# EAGLE design MCPv5_eingabe (EAGLE 9.6.2)
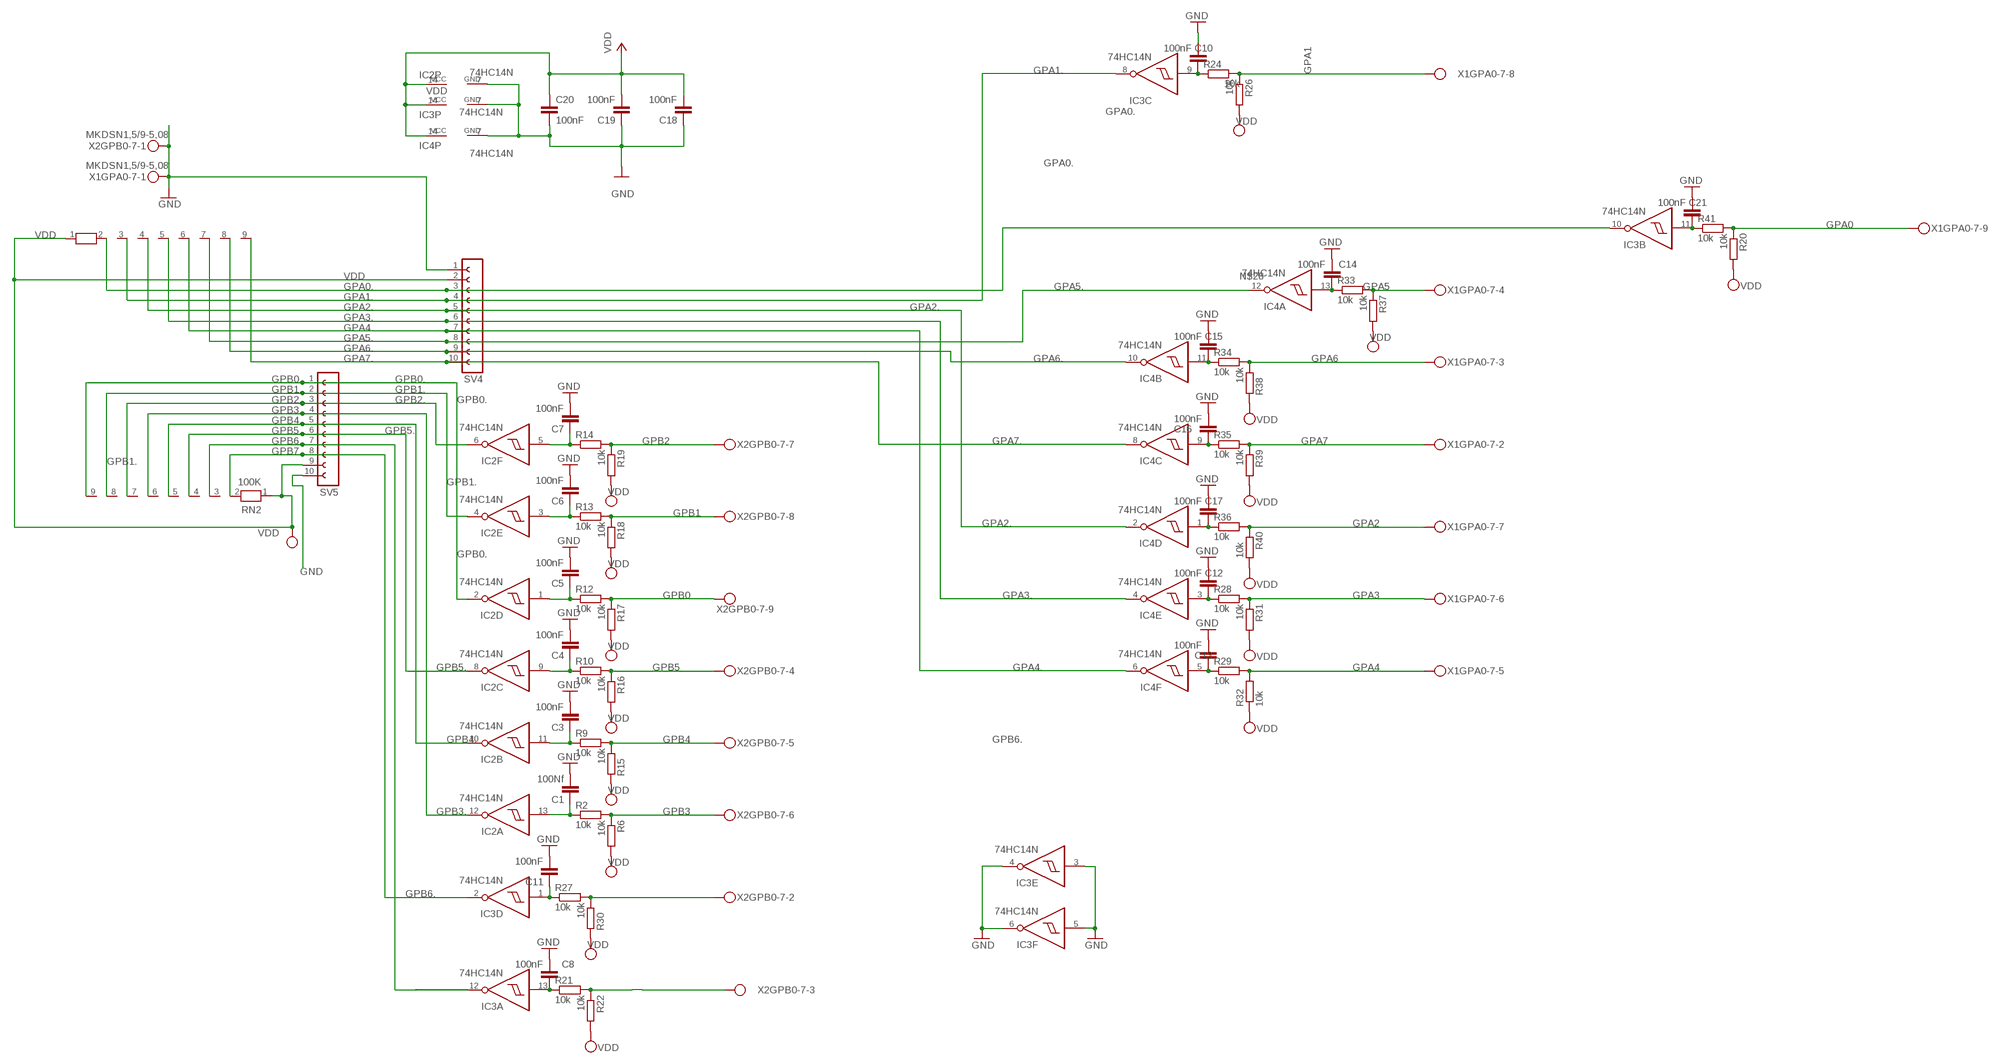
[diagram p0: schematic, sheet 1]

## Parts
C1  100Nf  C-EU025-024X044  [C025-024X044]
C3  100nF  C-EU025-024X044  [C025-024X044]
C4  100nF  C-EU025-024X044  [C025-024X044]
C5  100nF  C-EU025-024X044  [C025-024X044]
C6  100nF  C-EU025-024X044  [C025-024X044]
C7  100nF  C-EU025-024X044  [C025-024X044]
C8  100nF  C-EU025-024X044  [C025-024X044]
C10  100nF  C-EU025-024X044  [C025-024X044]
C11  100nF  C-EU025-024X044  [C025-024X044]
C12  100nF  C-EU025-024X044  [C025-024X044]
C13  100nF  C-EU025-024X044  [C025-024X044]
C14  100nF  C-EU025-024X044  [C025-024X044]
C15  100nF  C-EU025-024X044  [C025-024X044]
C16  100nF  C-EU025-024X044  [C025-024X044]
C17  100nF  C-EU025-024X044  [C025-024X044]
C18  100nF  C-EU025-024X044  [C025-024X044]
C19  100nF  C-EU025-024X044  [C025-024X044]
C20  100nF  C-EU025-024X044  [C025-024X044]
C21  100nF  C-EU025-024X044  [C025-024X044]
IC2  74HC14N  [DIL14]
IC3  74HC14N  [DIL14]
IC4  74HC14N  [DIL14]
R2  10k  R-EU_0204/7  [0204/7]
R6  10k  R-EU_0204/7  [0204/7]
R9  10k  R-EU_0204/7  [0204/7]
R10  10k  R-EU_0204/7  [0204/7]
R12  10k  R-EU_0204/7  [0204/7]
R13  10k  R-EU_0204/7  [0204/7]
R14  10k  R-EU_0204/7  [0204/7]
R15  10k  R-EU_0204/7  [0204/7]
R16  10k  R-EU_0204/7  [0204/7]
R17  10k  R-EU_0204/7  [0204/7]
R18  10k  R-EU_0204/7  [0204/7]
R19  10k  R-EU_0204/7  [0204/7]
R20  10k  R-EU_0204/7  [0204/7]
R21  10k  R-EU_0204/7  [0204/7]
R22  10k  R-EU_0204/7  [0204/7]
R24  10k  R-EU_0204/7  [0204/7]
R26  10k  R-EU_0204/7  [0204/7]
R27  10k  R-EU_0204/7  [0204/7]
R28  10k  R-EU_0204/7  [0204/7]
R29  10k  R-EU_0204/7  [0204/7]
R30  10k  R-EU_0204/7  [0204/7]
R31  10k  R-EU_0204/7  [0204/7]
R32  10k  R-EU_0204/7  [0204/7]
R33  10k  R-EU_0204/7  [0204/7]
R34  10k  R-EU_0204/7  [0204/7]
R35  10k  R-EU_0204/7  [0204/7]
R36  10k  R-EU_0204/7  [0204/7]
R37  10k  R-EU_0204/7  [0204/7]
R38  10k  R-EU_0204/7  [0204/7]
R39  10k  R-EU_0204/7  [0204/7]
R40  10k  R-EU_0204/7  [0204/7]
R41  10k  R-EU_0204/7  [0204/7]
RN1  100K  RN08  [RN-9]
RN2  100K  RN08  [RN-9]
SV4  FE10-1  [FE10]
SV5  FE10-1  [FE10]
X1GPA0-7  MKDSN1,5/9-5,08  [MKDSN1,5/9-5,08]
X2GPB0-7  MKDSN1,5/9-5,08  [MKDSN1,5/9-5,08]

## Nets
GND: C1.2 C3.2 C4.2 C5.2 C6.2 C7.2 C8.2 C10.2 C11.2 C12.2 C13.2 C14.2 C15.2 C16.2 C17.2 C18.1 C19.1 C20.2 C21.2 IC2.7(P:GND) IC3.3(E:I) IC3.4(E:O) IC3.5(F:I) IC3.6(F:O) IC3.7(P:GND) IC4.7(P:GND) SV4.1 SV5.10 X1GPA0-7.1 X2GPB0-7.1
GPA0: R20.1 R41.2 X1GPA0-7.9
GPA0.: IC3.10(B:O) RN1.2 SV4.3
GPA1: R24.2 R26.1 X1GPA0-7.8
GPA1.: IC3.8(C:O) RN1.3 SV4.4
GPA2: R36.2 R40.1 X1GPA0-7.7
GPA2.: IC4.2(D:O) RN1.4 SV4.5
GPA3: R28.2 R31.1 X1GPA0-7.6
GPA3.: IC4.4(E:O) RN1.5 SV4.6
GPA4: R29.2 R32.2 X1GPA0-7.5
GPA4.: IC4.6(F:O) RN1.6 SV4.7
GPA5: R33.2 R37.1 X1GPA0-7.4
GPA5.: IC4.12(A:O) RN1.7 SV4.8
GPA6: R34.2 R38.1 X1GPA0-7.3
GPA6.: IC4.10(B:O) RN1.8 SV4.9
GPA7: R35.2 R39.1 X1GPA0-7.2
GPA7.: IC4.8(C:O) RN1.9 SV4.10
GPB0: R12.2 R17.1 X2GPB0-7.9
GPB0.: IC2.2(D:O) RN2.9 SV5.1
GPB1: R13.2 R18.1 X2GPB0-7.8
GPB1.: IC2.4(E:O) RN2.8 SV5.2
GPB2: R14.2 R19.1 X2GPB0-7.7
GPB2.: IC2.6(F:O) RN2.7 SV5.3
GPB3: R2.2 R6.1 X2GPB0-7.6
GPB3.: IC2.12(A:O) RN2.6 SV5.4
GPB4: R9.2 R15.1 X2GPB0-7.5
GPB4.: IC2.10(B:O) RN2.5 SV5.5
GPB5: R10.2 R16.1 X2GPB0-7.4
GPB5.: IC2.8(C:O) RN2.4 SV5.6
GPB6: R21.2 R22.1 X2GPB0-7.3
GPB6.: IC3.12(A:O) RN2.3 SV5.7
GPB7: R27.2 R30.1 X2GPB0-7.2
GPB7.: IC3.2(D:O) RN2.2 SV5.8
N$2: C7.1 IC2.5(F:I) R14.1
N$4: C1.1 IC2.13(A:I) R2.1
N$5: C6.1 IC2.3(E:I) R13.1
N$6: C5.1 IC2.1(D:I) R12.1
N$7: C4.1 IC2.9(C:I) R10.1
N$8: C3.1 IC2.11(B:I) R9.1
N$9: C8.1 IC3.13(A:I) R21.1
N$10: C10.1 IC3.9(C:I) R24.1
N$11: C11.1 IC3.1(D:I) R27.1
N$12: C12.1 IC4.3(E:I) R28.1
N$13: C13.1 IC4.5(F:I) R29.1
N$16: C15.1 IC4.11(B:I) R34.1
N$20: C16.1 IC4.9(C:I) R35.1
N$21: C17.1 IC4.1(D:I) R36.1
N$28: C14.1 IC4.13(A:I) R33.1
N$52: C21.1 IC3.11(B:I) R41.1
VDD: C18.2 C19.2 C20.1 IC2.14(P:VCC) IC3.14(P:VCC) IC4.14(P:VCC) R6.2 R15.2 R16.2 R17.2 R18.2 R19.2 R20.2 R22.2 R26.2 R30.2 R31.2 R32.1 R37.2 R38.2 R39.2 R40.2 RN1.1 RN2.1 SV4.2 SV5.9

## Library data of the parts
C1 C3-C8 C10-C21 = rcl:C-EU: CAPACITOR, European symbol; SPICEPREFIX: C
IC2-IC4 = 74xx-eu:74*14: Hex schmitt trigger INVERTER
R2 R6 R9 R10 R12-R22 R24 R26-R41 = resistor:R-EU_: RESISTOR, European symbol
RN1 = resistor-net:RN08: RESISTOR NETWORK; OC_FARNELL: unknown; OC_NEWARK: unknown; SPICEPREFIX: X
RN2 = resistor-net:RN08: RESISTOR NETWORK; OC_FARNELL: unknown; OC_NEWARK: unknown
SV4 SV5 = con-lsta:FE10-1: FEMALE HEADER; OC_FARNELL: unknown; OC_NEWARK: unknown
X1GPA0-7 X2GPB0-7 = con-phoenix-508:MKDSN1,5/9-5,08: MKDSN 1,5/ 9-5,08 Printklemme Nennstrom: 13,5 A Nennspannung: 250 V Rastermaß: 5,08 mm Polzahl: 9 Anschlussart: Schraubanschluss Montage: Löten Anschlussrichtung Leiter/Platine: 0 ° Artikelnummer: 1729199 Source: http://eshop.phoenixcontact.com .. 1729199.pdf

## Board
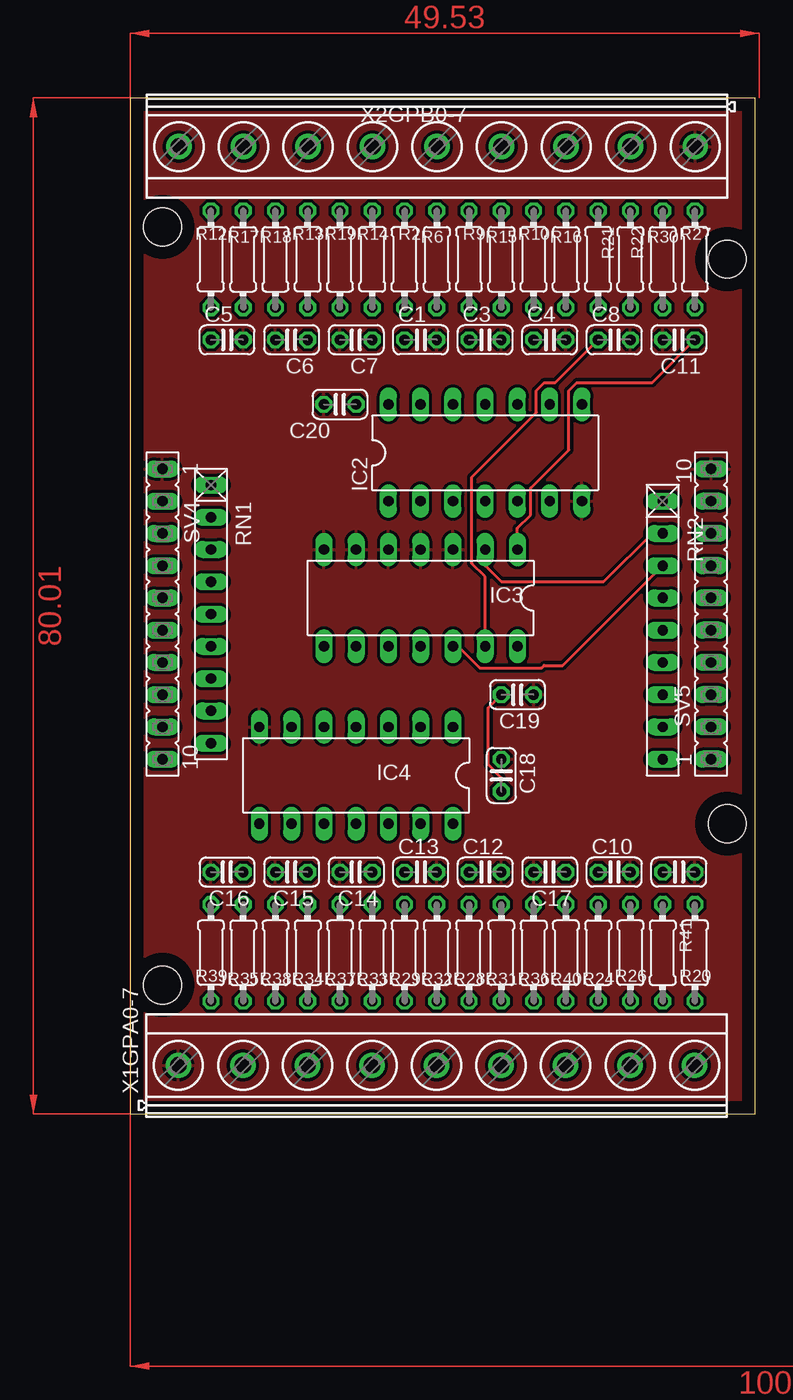
[diagram p1: board, top side]
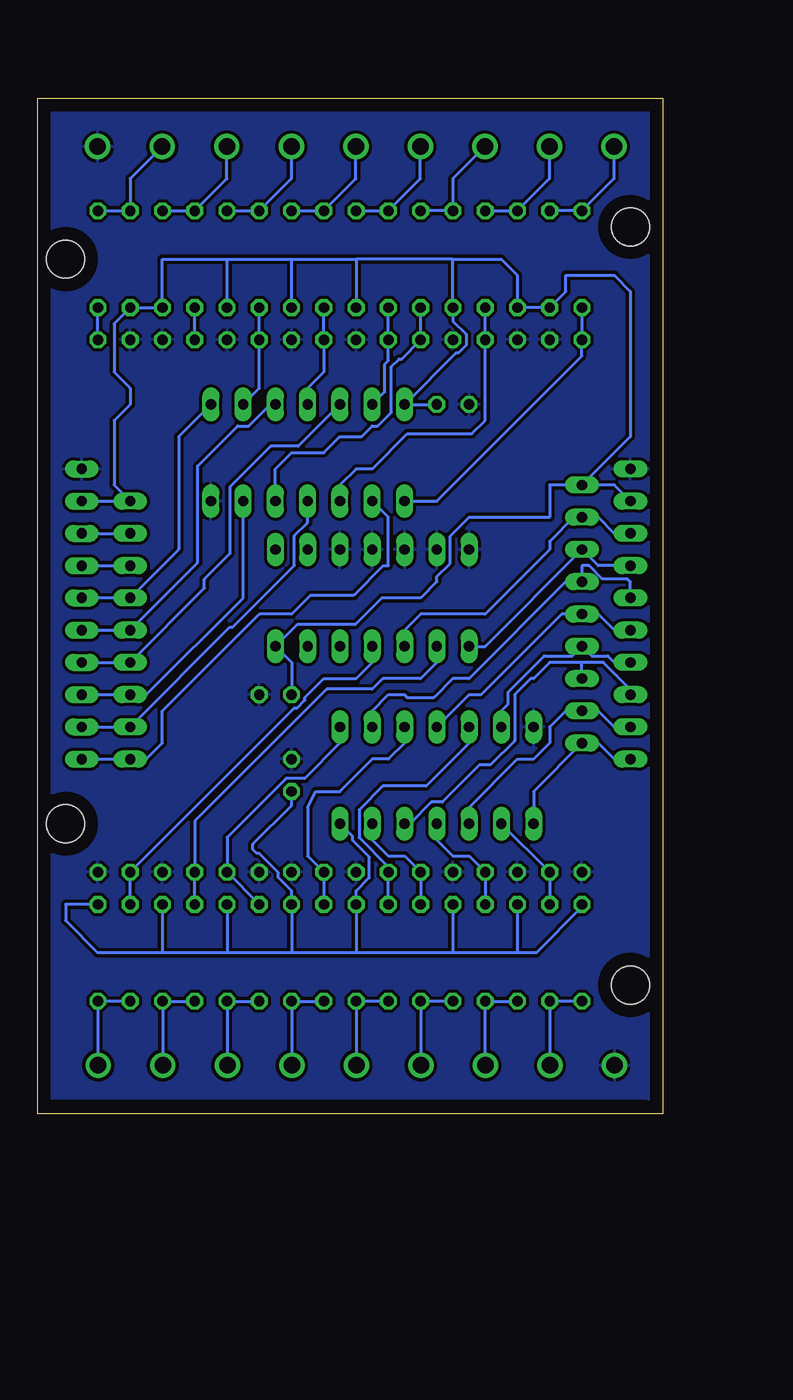
[diagram p2: board, bottom side, seen from below]

Size 49.2 x 80 mm. Coordinates in mm from the lower left corner, seen from the top.
Outline: 0,0 49.2,0 49.2,80 0,80 0,0
Copper layers (1*16): Top 0.035mm / dielectric 1.5mm / Bottom 0.035mm
Design rules "platinenbelichter": minimum track width 10mil, minimum drill 24mil, track to track 10mil, track to pad 10mil, pad to pad 10mil, via to via 10mil, smd to smd 10mil, copper to edge 40mil, drill to drill 8mil, minimum pad ring 10mil, minimum via ring 8mil, stop-mask expansion 10mil, vias tented up to drill 0mil, thermal gap 10mil
Holes 3 mm at 2.54,69.85 46.99,22.86 2.54,10.16 46.99,67.31

### Footprints (pad centres in the part's own frame; a part is rotated, then mirrored left to right if it is on the bottom)
C025-024X044 = drill 0.813 octagon: 1 -1.27,0; 2 1.27,0
DIL14 = drill 0.813 long: 1 -7.62,-3.81; 2 -5.08,-3.81; 3 -2.54,-3.81; 4 0,-3.81; 5 2.54,-3.81; 6 5.08,-3.81; 7 7.62,-3.81; 8 7.62,3.81; 9 5.08,3.81; 10 2.54,3.81; 11 0,3.81; 12 -2.54,3.81; 13 -5.08,3.81; 14 -7.62,3.81
0204/7 = drill 0.813 octagon: 1 -3.81,0; 2 3.81,0
RN-9 = drill 0.813 long: 1 -10.16,0; 2 -7.62,0; 3 -5.08,0; 4 -2.54,0; 5 0,0; 6 2.54,0; 7 5.08,0; 8 7.62,0; 9 10.16,0
FE10 = drill 0.813 long: 1 -11.43,0; 2 -8.89,0; 3 -6.35,0; 4 -3.81,0; 5 -1.27,0; 6 1.27,0; 7 3.81,0; 8 6.35,0; 9 8.89,0; 10 11.43,0
MKDSN1,5/9-5,08 = drill 1.3 pad 2: 1 -20.341,0.025; 2 -15.261,0.025; 3 -10.181,0.025; 4 -5.101,0.025; 5 -0.021,0.025; 6 5.059,0.025; 7 10.139,0.025; 8 15.219,0.025; 9 20.299,0.025

### Placement (x,y rotation side)
C1  22.86,60.96 0 top
C3  27.94,60.96 0 top
C4  33.02,60.96 0 top
C5  7.62,60.96 0 top
C6  12.7,60.96 180 top
C7  17.78,60.96 180 top
C8  38.1,60.96 0 top
C10  38.1,19.05 0 top
C11  43.18,60.96 180 top
C12  27.94,19.05 0 top
C13  22.86,19.05 0 top
C14  17.78,19.05 180 top
C15  12.7,19.05 180 top
C16  7.62,19.05 180 top
C17  33.02,19.05 180 top
C18  29.21,26.67 270 top
C19  30.48,33.02 180 top
C20  16.51,55.88 180 top
C21  43.18,19.05 0 top
IC2  27.94,52.07 0 top
IC3  22.86,40.64 180 top
IC4  17.78,26.67 180 top
R2  21.59,67.31 90 top
R6  24.13,67.31 270 top
R9  26.67,67.31 90 top
R10  31.75,67.31 90 top
R12  6.35,67.31 90 top
R13  13.97,67.31 90 top
R14  19.05,67.31 90 top
R15  29.21,67.31 270 top
R16  34.29,67.31 270 top
R17  8.89,67.31 270 top
R18  11.43,67.31 270 top
R19  16.51,67.31 270 top
R20  44.45,12.7 90 top
R21  36.83,67.31 90 top
R22  39.37,67.31 270 top
R24  36.83,12.7 270 top
R26  39.37,12.7 90 top
R27  44.45,67.31 90 top
R28  26.67,12.7 270 top
R29  21.59,12.7 270 top
R30  41.91,67.31 270 top
R31  29.21,12.7 90 top
R32  24.13,12.7 270 top
R33  19.05,12.7 270 top
R34  13.97,12.7 270 top
R35  8.89,12.7 270 top
R36  31.75,12.7 270 top
R37  16.51,12.7 90 top
R38  11.43,12.7 90 top
R39  6.35,12.7 90 top
R40  34.29,12.7 90 top
R41  41.91,12.7 270 top
RN1  6.35,39.37 270 top
RN2  41.91,38.1 270 top
SV4  2.54,39.37 270 top
SV5  45.72,39.37 90 top
X1GPA0-7  24.13,3.81 0 top
X2GPB0-7  24.13,76.2 180 top

### Tracks (layer width: path | path; a pad name or v marks a point on that pad's centre or on a via)
GND
  pour Bottom: 0,80.01 49.53,80.01 49.53,1.27 1.27,1.27 0,0
  pour Top: 0,80.01 49.53,80.01 49.53,0 0,0
GPA0
  Bottom 0.254: R41.2 R20.1 44.45,3.86 X1GPA0-7.9
GPA0.
  Bottom 0.254: IC3.10 20.32,38.1 19.05,39.37 13.97,39.37 8.89,44.45 8.89,45.09 6.99,46.99 RN1.2 5.08,46.99 3.81,45.72 SV4.3
GPA1
  Bottom 0.254: R24.2 R26.1 39.35,8.87 X1GPA0-7.8
GPA1.
  Bottom 0.254: IC3.8 13.97,36.83 RN1.3 5.08,43.18 SV4.4
GPA2
  Bottom 0.254: R36.2 R40.1 34.27,8.87 X1GPA0-7.7
GPA2.
  Bottom 0.254: SV4.5 2.54,41.91 2.77,42.14 4.76,42.14 5.8,43.18 6.35,43.18 RN1.4 7.62,41.91 15.24,34.29 16.51,34.29 17.98,32.82 20.12,32.82 20.32,33.02 21.59,33.02 22.86,31.75 IC4.2
GPA3
  Bottom 0.254: X1GPA0-7.6 29.19,8.87 R31.1 R28.2
GPA3.
  Bottom 0.254: SV4.6 3.81,38.1 5.08,39.37 RN1.5 7.93,39.37 14.28,33.02 15.24,33.02 IC4.4
GPA4
  Bottom 0.254: R29.2 R32.2 24.11,8.87 X1GPA0-7.5
GPA4.
  Bottom 0.254: SV4.7 3.81,35.56 4.32,36.07 5.59,36.07 RN1.6 7.11,36.07 9.33,36.07 12.17,33.23 12.17,32.28 12.7,31.75 IC4.6
GPA5
  Bottom 0.254: R37.1 R33.2 19.03,8.87 X1GPA0-7.4
GPA5.
  Bottom 0.254: IC4.12 19.91,22.86 18.21,24.56 17.35,24.56 14.4,27.51 13.54,27.51 11.66,29.39 11.66,33.02 10.39,34.29 10.16,34.29 8.89,35.56 6.35,35.56 | RN1.7 6.35,35.56 | 6.35,35.56 4.67,35.56 3.61,34.49 3.4,34.29 2.54,33.43 SV4.8
GPA6
  Bottom 0.254: X1GPA0-7.3 13.97,3.86 R34.2 R38.1
GPA6.
  Bottom 0.254: SV4.9 3.81,30.48 5.08,31.75 RN1.8 7.62,31.75 8.89,30.48 8.89,29.21 10.16,27.94 11.43,27.94 15.24,24.13 IC4.10
GPA7
  Bottom 0.254: R39.1 R35.2 8.89,3.86 X1GPA0-7.2
GPA7.
  Bottom 0.254: IC4.8 10.16,25.4 RN1.9 5.08,29.21 3.81,27.94 SV4.10
GPB0
  Bottom 0.254: X2GPB0-7.9 3.83,73.64 R12.2 R17.1
GPB0.
  Bottom 0.254: SV5.1 RN2.9 40.64,27.94 39.37,29.21 39.37,31.75 31.75,39.37 29.21,39.37 27.74,40.84 24.33,40.84 22,43.18 21.59,43.18 21.59,46.99 IC2.2
GPB1
  Bottom 0.254: R13.2 R18.1 8.91,73.64 X2GPB0-7.8
GPB1.
  Bottom 0.254: SV5.2 RN2.8 34.06,38.33 33.86,38.33 28.98,43.21 28.98,45.54 27.94,46.58 IC2.4
GPB2
  Bottom 0.254: X2GPB0-7.7 16.51,73.66 R19.1 R14.2
GPB2.
  Bottom 0.254: SV5.3 RN2.7 40.64,33.02 33.02,40.64 IC2.6
GPB3
  Bottom 0.254: R6.1 R2.2 19.07,73.64 X2GPB0-7.6
GPB3.
  Bottom 0.254: SV5.4 RN2.6 36.07,41.4 36.07,42.12 34.06,44.13 34.06,49.35 30.84,52.58 28.7,52.58 IC2.12
GPB4
  Bottom 0.254: R15.1 R9.2 24.15,73.64 X2GPB0-7.5
GPB4.
  Bottom 0.254: SV5.5 RN2.5 36.6,43.41 36.6,51.03 33.45,54.18 32.59,54.18 30.89,55.88 IC2.10
GPB5
  Bottom 0.254: X2GPB0-7.4 29.23,73.64 R10.2 R16.1
GPB5.
  Bottom 0.254: IC2.8 38.1,53.34 38.1,44.45 RN2.4 SV5.6
GPB6
  Bottom 0.254: R22.1 R21.2 34.31,73.64 X2GPB0-7.3
GPB6.
  Top 0.254: IC3.12 25.81,36.83 27.51,35.13 32.38,35.13 32.59,35.33 34.06,35.33 RN2.3
  Bottom 0.254: SV5.7 RN2.3
GPB7
  Bottom 0.254: R27.2 R30.1 41.91,73.66 X2GPB0-7.2
GPB7.
  Top 0.254: RN2.2 41.07,45.72 37.26,41.91 29.21,41.91 27.94,43.18 IC3.2
  Bottom 0.254: SV5.8 RN2.2
N$2
  Bottom 0.254: R14.1 C7.1 20.55,59.46 20.75,59.46 21.36,58.85 21.36,55.24 22.43,54.18 22.86,54.18 23.7,53.34 25.4,53.34 26.67,52.07 29.21,52.07 30.48,50.8 IC2.5
N$4
  Bottom 0.254: IC2.13 21.87,56.87 21.87,59.06 21.59,59.34 C1.1 R2.1
N$5
  Bottom 0.254: R13.1 C6.1 13.97,54.61 15.01,53.57 20.09,53.57 22.86,50.8 24.13,50.8 25.4,49.53 IC2.3
N$6
  Bottom 0.254: R12.1 C5.1 6.35,59.69 17.78,48.26 IC2.1
N$7
  Bottom 0.254: IC2.9 31.75,57.15 C4.1 R10.1
N$8
  Bottom 0.254: R9.1 C3.1 26.67,58.42 27.94,57.15 IC2.11
N$9
  Top 0.254: IC3.13 27.94,42.32 26.9,43.36 26.9,50.16 31.98,55.24 31.98,56.97 32.59,57.58 33.45,57.58 C8.1
  Bottom 0.254: C8.1 R21.1
N$10
  Bottom 0.254: R24.1 C10.1 36.83,23.06 26.44,33.45 22.86,33.45 22.02,34.29 19.05,34.29 17.78,35.56 IC3.9
N$11
  Top 0.254: C11.1 41.07,57.58 35.13,57.58 34.52,56.97 34.52,52.3 31.52,49.3 31.52,47.17 30.48,46.13 IC3.1
  Bottom 0.254: C11.1 R27.1
N$12
  Bottom 0.254: R28.1 C12.1 27.94,20.32 27.94,24.13 27.3,25.4 25.4,25.4 22.86,27.94 21.59,27.94 20.32,29.21 IC4.3
N$13
  Bottom 0.254: IC4.5 15.24,29.21 18.62,25.83 22.02,25.83 23.9,23.95 23.9,21.77 21.59,19.46 C13.1 R29.1
N$16
  Bottom 0.254: IC4.11 17.78,21.59 16.51,20.32 15.24,20.32 C15.1 R34.1
N$20
  Bottom 0.254: IC4.9 C16.1 R35.1
N$21
  Bottom 0.254: IC4.1 25.4,29.21 28.17,26.44 29.64,26.44 34.29,21.79 C17.1 R36.1
N$28
  Bottom 0.254: R33.1 C14.1 20.32,20.32 21.59,20.32 22.86,21.59 IC4.13
N$52
  Bottom 0.254: R41.1 C21.1 28.98,31.98 28.78,31.98 28.17,32.59 28.17,32.79 26.67,34.29 24.13,34.29 22.86,35.56 IC3.11
VDD
  Top 0.254: C18.2 29.21,26.47 28.17,27.51 28.17,31.98 C19.2
  Bottom 0.254: R39.2 6.35,16.31 9.96,12.7 11.43,12.7 | 11.43,12.7 16.51,12.7 | 16.51,12.7 24.13,12.7 | 24.13,12.7 29.21,12.7 | 29.21,12.7 34.29,12.7 | 34.29,12.7 39.37,12.7 | 39.37,12.7 44.45,12.7 46.99,15.24 46.99,16.51 R20.2 | R26.2 39.37,12.7 | IC4.14 24.41,21.87 24.41,21.56 23.09,20.24 23.09,18.62 24.13,17.58 R32.1 24.13,12.7 | C18.2 29.21,24.3 32.26,21.25 32.26,20.83 31.96,20.53 31.76,20.53 30.25,19.02 30.25,18.62 29.21,17.58 R31.2 29.21,12.7 | RN1.1 8.89,49.53 8.89,46.99 15.24,46.99 16.74,45.49 16.74,43.36 17.78,42.32 17.78,41.91 19.05,40.64 22.1,40.64 24.21,38.53 28.78,38.53 IC3.14 29.21,35.56 C19.2 | 16.51,67.31 R19.2 16.51,62.43 15.47,61.39 15.47,60.53 16.08,59.92 16.28,59.92 IC2.14 C20.1 | 16.51,67.31 12.7,67.31 11.43,66.04 R18.2 R17.2 7.62,64.77 7.62,66.04 3.81,66.04 2.54,64.77 2.54,53.34 RN1.1 | 16.51,67.31 24.13,67.31 | 24.13,67.31 R6.2 | 29.21,67.31 24.13,67.31 | R15.2 29.21,67.31 | R16.2 34.29,67.31 | 34.29,67.31 29.21,67.31 | 34.29,67.31 39.37,67.31 R22.2 R30.2 43.18,62.23 43.18,58.42 41.91,57.15 41.91,55.88 43.18,54.61 43.18,49.53 RN2.1 SV5.9 | SV4.2 3.81,49.53 RN1.1 | R40.2 34.29,12.7 | R38.2 11.43,12.7 | R37.2 16.51,12.7
(copper drawn outside any net)
  shapes: Top area x3

### Text on the board
tDocu: SX2MCP23017 / INPUT / Version V5